# EAGLE design RCM-CamLight_v1 (EAGLE 9.3.1)
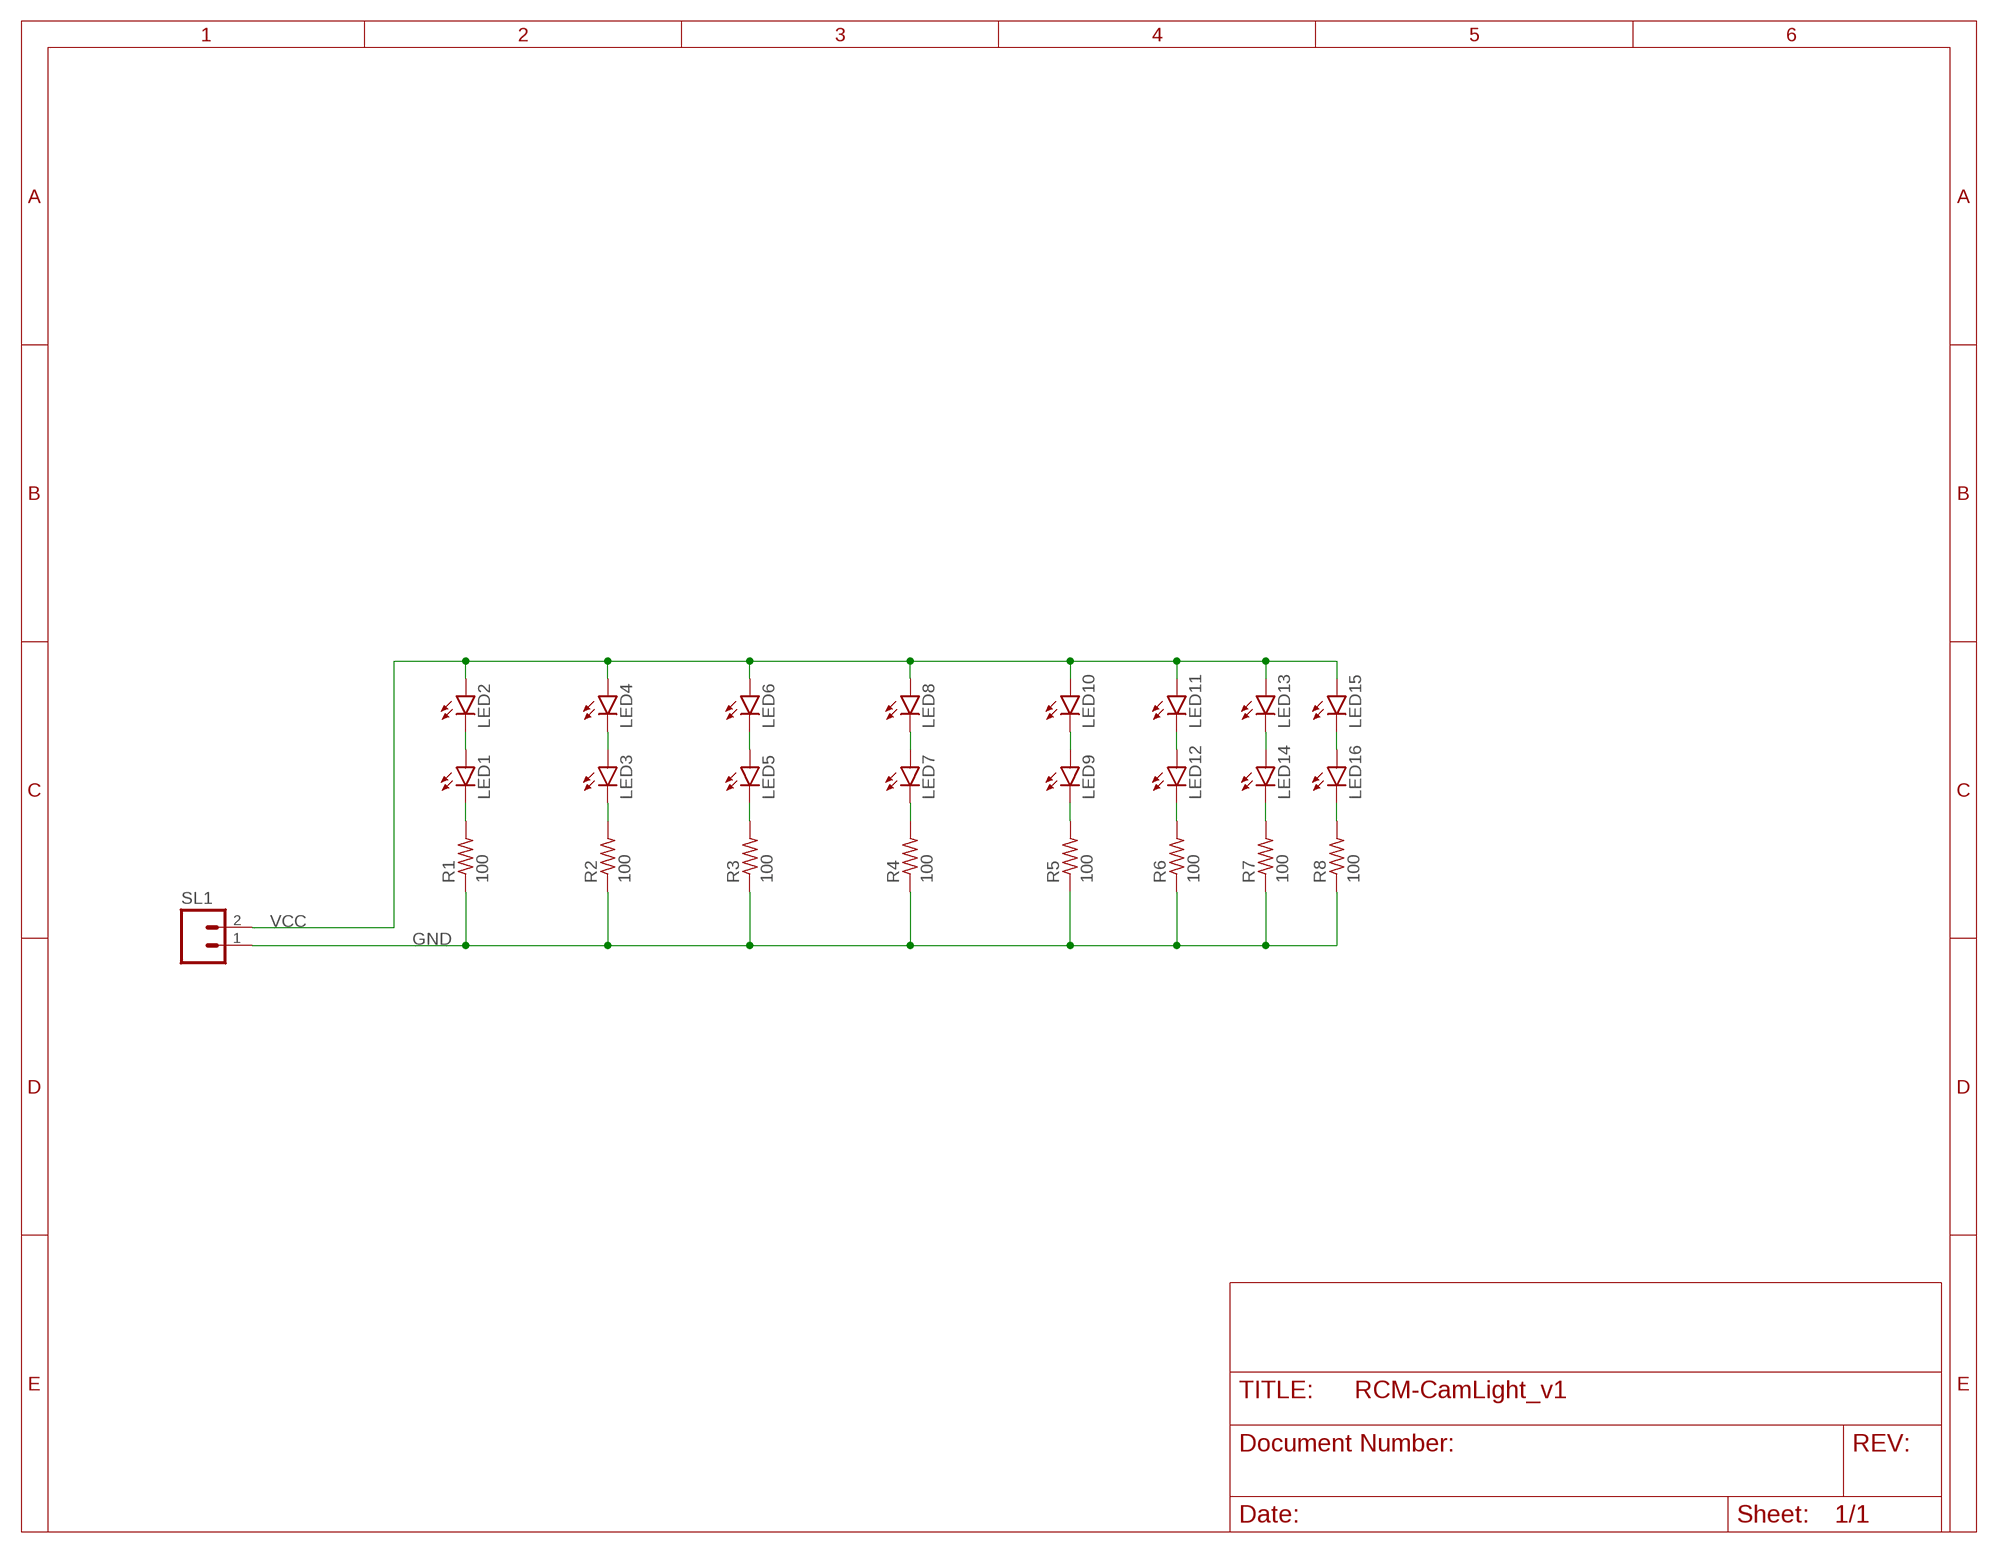
[diagram p0: schematic, sheet 1]

## Parts
LED1  LED3MM  [LED3MM]
LED2  LED3MM  [LED3MM]
LED3  LED3MM  [LED3MM]
LED4  LED3MM  [LED3MM]
LED5  LED3MM  [LED3MM]
LED6  LED3MM  [LED3MM]
LED7  LED3MM  [LED3MM]
LED8  LED3MM  [LED3MM]
LED9  LED3MM  [LED3MM]
LED10  LED3MM  [LED3MM]
LED11  LED3MM  [LED3MM]
LED12  LED3MM  [LED3MM]
LED13  LED3MM  [LED3MM]
LED14  LED3MM  [LED3MM]
LED15  LED3MM  [LED3MM]
LED16  LED3MM  [LED3MM]
R1  100  R-US_0204/7  [0204/7]
R2  100  R-US_0204/7  [0204/7]
R3  100  R-US_0204/7  [0204/7]
R4  100  R-US_0204/7  [0204/7]
R5  100  R-US_0204/7  [0204/7]
R6  100  R-US_0204/7  [0204/7]
R7  100  R-US_0204/7  [0204/7]
R8  100  R-US_0204/7  [0204/7]
SL1  M02  [02P]

## Nets
GND: R1.1 R2.1 R3.1 R4.1 R5.1 R6.1 R7.1 R8.1 SL1.1
N$1: LED9.A LED10.K(C)
N$3: LED12.K(C) R6.2
N$4: LED1.K(C) R1.2
N$5: LED1.A LED2.K(C)
N$6: LED3.A LED4.K(C)
N$7: LED3.K(C) R2.2
N$8: LED5.K(C) R3.2
N$9: LED5.A LED6.K(C)
N$10: LED7.A LED8.K(C)
N$11: LED7.K(C) R4.2
N$12: LED9.K(C) R5.2
N$14: LED14.K(C) R7.2
N$15: LED11.K(C) LED12.A
N$18: LED16.K(C) R8.2
N$19: LED15.K(C) LED16.A
N$20: LED13.K(C) LED14.A
VCC: LED2.A LED4.A LED6.A LED8.A LED10.A LED11.A LED13.A LED15.A SL1.2

## Library data of the parts
LED1-LED16 = led:LED: LED OSRAM: - CHIPLED LG R971, LG N971, LY N971, LG Q971, LY Q971, LO R971, LY R971 LH N974, LH R974 LS Q976, LO Q976, LY Q976 LO Q996 - Hyper CHIPLED LW Q18S LB Q993, LB Q99A, LB R99A - SideLED LS A670, LO A670, LY A670, LG A670, LP A670 LB A673, LV A673, LT A673, LW A673 LH A674 LY A675 LS A676, LA A676, LO A676, LY A676, LW A676 LS A679, LY A679, LG A679 - Hyper Micro SIDELED® LS Y876, LA Y876, LO Y876, LY Y876 LT Y87S - SmartLED LW L88C, LW L88S LB L89C, LB L89S, LG L890 LS L89K, LO L89K, LY L89K LS L896, LA L896, LO L896, LY L896 - TOPLED LS T670, LO T670, LY T670, LG T670, LP T670 LSG T670, LSP T670, LSY T670, LOP T670, LYG T670 LG T671, LOG T671, LSG T671 LB T673, LV T673, LT T673, LW T673 LH T674 LS T676, LA T676, LO T676, LY T676, LB T676, LH T676, LSB T676, LW T676 LB T67C, LV T67C, LT T67C, LS T67K, LO T67K, LY T67K, LW E67C LS E67B, LA E67B, LO E67B, LY E67B, LB E67C, LV E67C, LT E67C LW T67C LS T679, LY T679, LG T679 LS T770, LO T770, LY T770, LG T770, LP T770 LB T773, LV T773, LT T773, LW T773 LH T774 LS E675, LA E675, LY E675, LS T675 LS T776, LA T776, LO T776, LY T776, LB T776 LHGB T686 LT T68C, LB T68C - Hyper Mini TOPLED® LB M676 - Mini TOPLED Santana® LG M470 LS M47K, LO M47K, LY M47K Source: http://www.osram.convergy.de LUXEON: - LUMILED® LXK2-PW12-R00, LXK2-PW12-S00, LXK2-PW14-U00, LXK2-PW14-V00 LXK2-PM12-R00, LXK2-PM12-S00, LXK2-PM14-U00 LXK2-PE12-Q00, LXK2-PE12-R00, LXK2-PE12-S00, LXK2-PE14-T00, LXK2-PE14-U00 LXK2-PB12-K00, LXK2-PB12-L00, LXK2-PB12-M00, LXK2-PB14-N00, LXK2-PB14-P00, LXK2-PB14-Q00 LXK2-PR12-L00, LXK2-PR12-M00, LXK2-PR14-Q00, LXK2-PR14-R00 LXK2-PD12-Q00, LXK2-PD12-R00, LXK2-PD12-S00 LXK2-PH12-R00, LXK2-PH12-S00 LXK2-PL12-P00, LXK2-PL12-Q00, LXK2-PL12-R00 Source: www.luxeon.com KINGBRIGHT: KA-3528ASYC Source: www.kingbright.com
R1-R8 = rcl:R-US_: RESISTOR, American symbol; SPICEPREFIX: R
SL1 = con-amp-quick:M02: AMP QUICK CONNECTOR; OC_FARNELL: unknown; OC_NEWARK: unknown

## Board
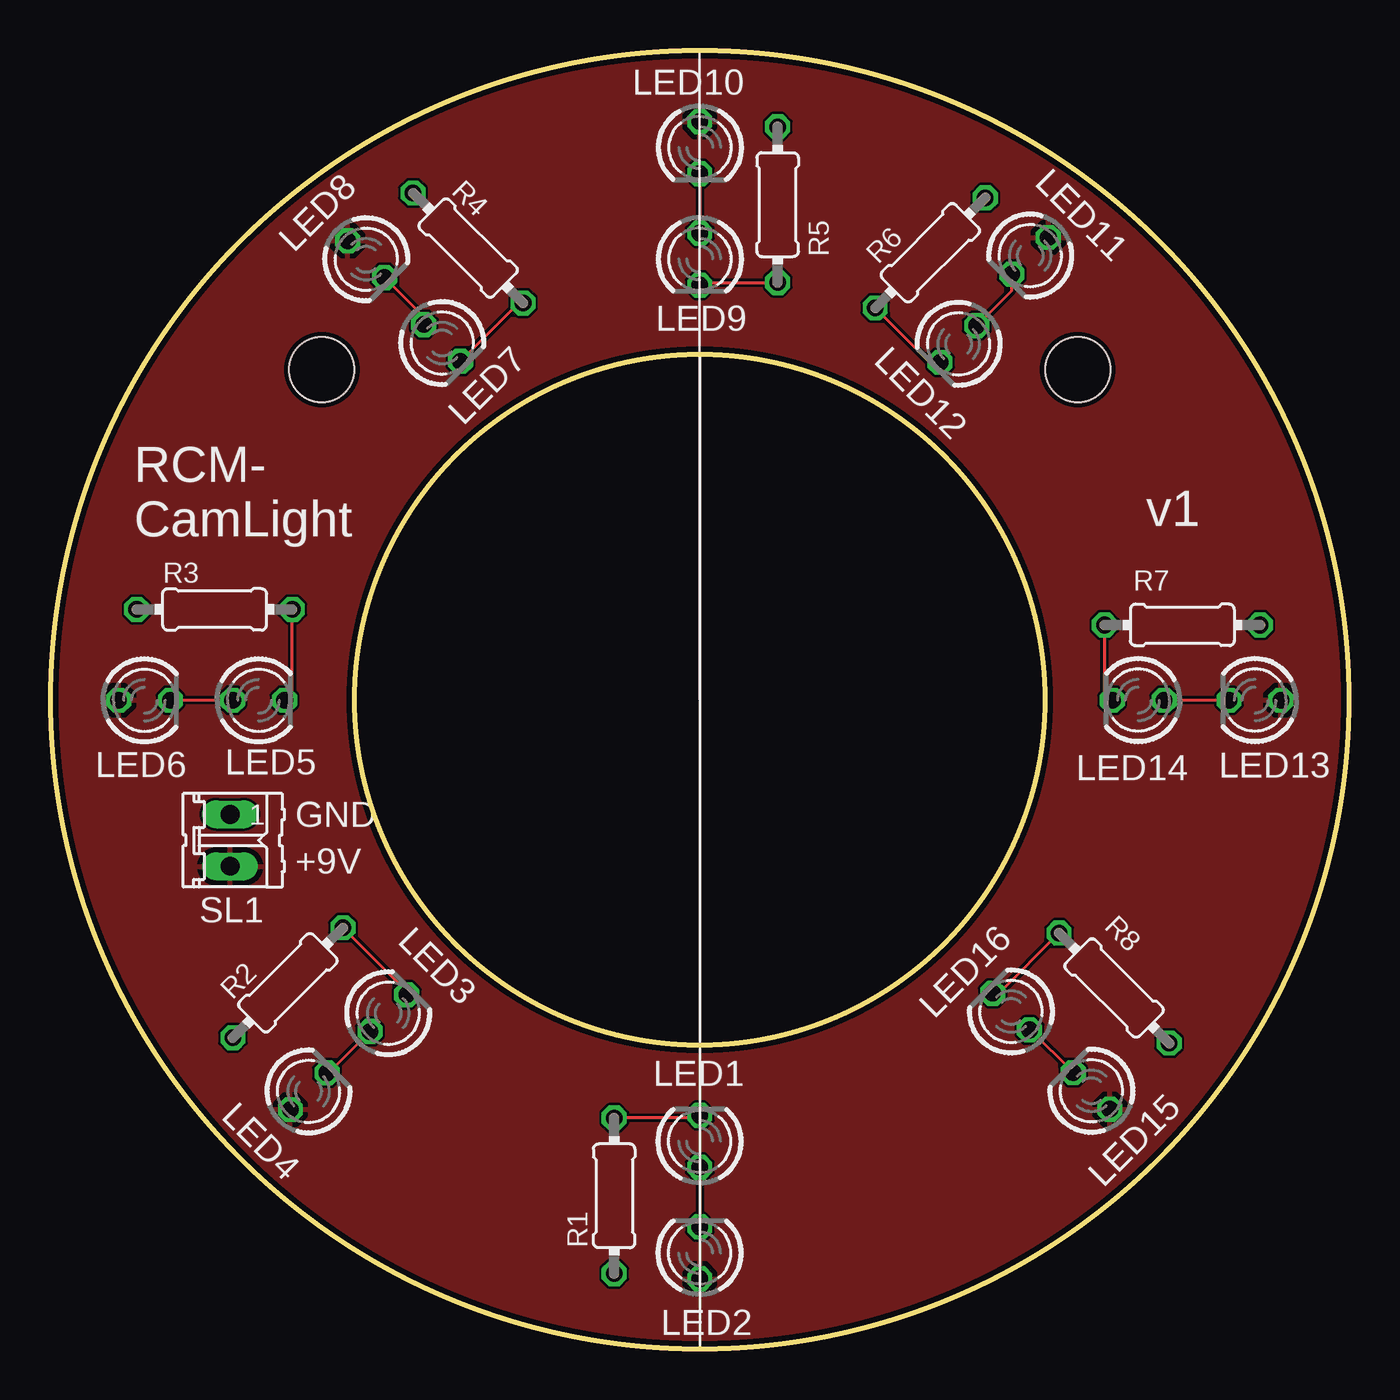
[diagram p1: board, top side]
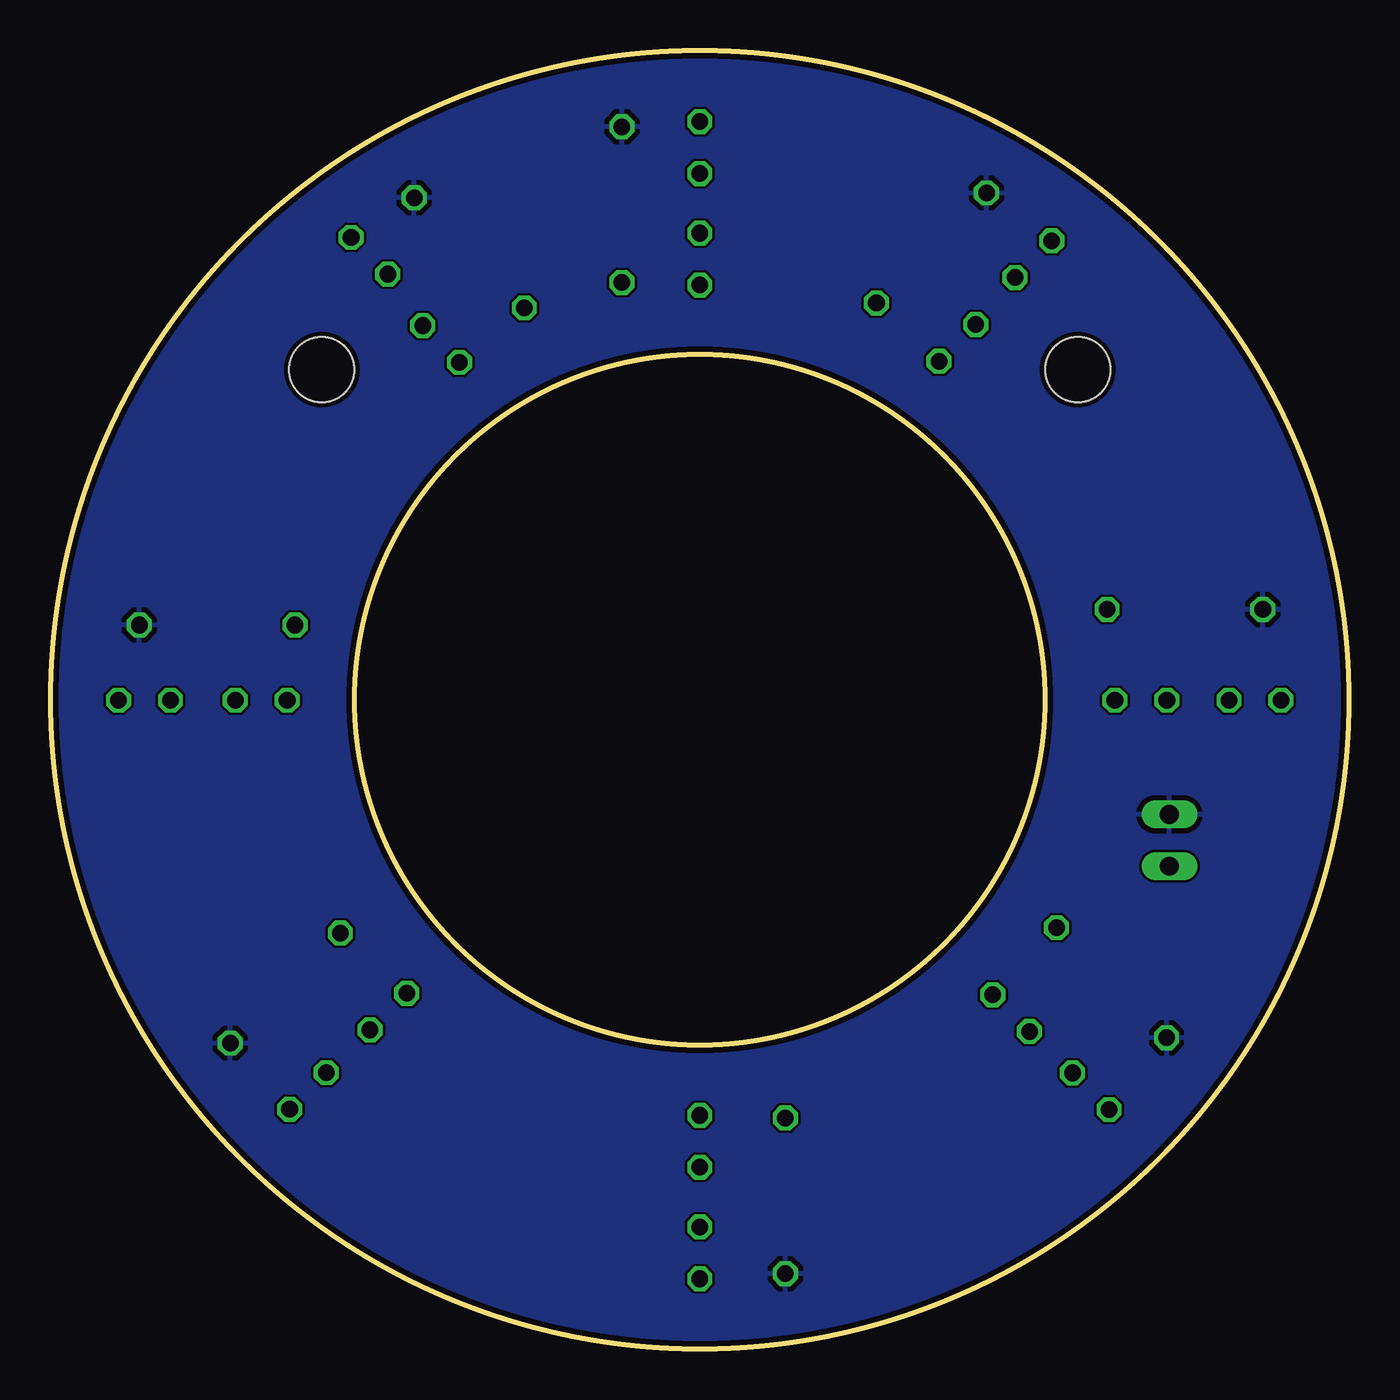
[diagram p2: board, bottom side, seen from below]

Size 63.5 x 63.5 mm. Coordinates in mm from the lower left corner, seen from the top.
Outline: circle at 31.75,31.75 radius 16.89
Outline: circle at 31.75,31.75 radius 31.75
Copper layers (1*16): Top 0.035mm / dielectric 0.2mm / Bottom 0.035mm
Design rules "JLCPCB_DRU_2layer *": minimum track width 5mil, minimum drill 0.3mm, track to track 5mil, track to pad 5mil, pad to pad 5mil, via to via 5mil, smd to smd 5mil, copper to edge 10mil, drill to drill 10mil, minimum pad ring 6mil, minimum via ring 6mil, stop-mask expansion 2mil, vias tented up to drill 25mil, thermal gap 10mil
Holes 3.17 mm at 13.25,47.9 50.25,47.9

### Footprints (pad centres in the part's own frame; a part is rotated, then mirrored left to right if it is on the bottom)
LED3MM = drill 0.813 octagon: A -1.27,0; K 1.27,0
0204/7 = drill 0.813 octagon: 1 -3.81,0; 2 3.81,0
02P = drill 0.914 long: 1 -1.27,0; 2 1.27,0

### Placement (x,y rotation side)
LED1  31.75,10.14 90 top
LED2  31.75,4.68 90 top
LED3  16.51,16.41 45 top
LED4  12.61,12.59 45 top
LED5  10.16,31.73 0 top
LED6  4.57,31.73 0 top
LED7  19.14,49.22 315 top
LED8  15.42,53.32 315 top
LED9  31.75,53.32 270 top
LED10  31.75,58.78 270 top
LED11  47.92,53.48 225 top
LED12  44.41,49.16 225 top
LED13  58.93,31.73 180 top
LED14  53.21,31.73 180 top
LED15  50.93,12.6 135 top
LED16  46.99,16.49 135 top
R1  27.56,7.47 90 top
R2  11.59,17.9 45 top
R3  8,36.17 0 top
R4  20.41,53.86 315 top
R5  35.56,55.98 270 top
R6  43.03,53.62 225 top
R7  55.37,35.41 180 top
R8  52.03,17.64 135 top
SL1  8.76,24.87 270 top

### Tracks (layer width: path | path; a pad name or v marks a point on that pad's centre or on a via)
GND
  pour Bottom: -3.81,66.14 67.31,66.14 67.31,-2.44 -3.81,-2.44
N$1
  Top 0.152: LED10.K LED9.A
N$3
  Top 0.152: R6.2 43,48.27 LED12.K
N$4
  Top 0.152: LED1.K 31.62,11.28 R1.2
N$5
  Top 0.152: LED1.A LED2.K
N$6
  Top 0.152: LED3.A 13.58,13.49 LED4.K
N$7
  Top 0.152: R2.2 17.41,17.47 LED3.K
N$8
  Top 0.152: LED5.K 11.81,32.11 R3.2
N$9
  Top 0.152: LED6.K LED5.A
N$10
  Top 0.152: LED8.K 18.24,50.5 LED7.A
N$11
  Top 0.152: LED7.K 22.89,51.17 R4.2
N$12
  Top 0.152: LED9.K 31.88,52.17 R5.2
N$14
  Top 0.152: R7.2 51.56,32.11 LED14.K
N$15
  Top 0.152: LED12.A 47.02,51.77 LED11.K
N$18
  Top 0.152: R8.2 46.39,17.39 LED16.K
N$19
  Top 0.152: LED15.K 47.94,15.59 LED16.A
N$20
  Top 0.152: LED14.A LED13.K
VCC
  pour Top: -3.81,66.14 67.31,66.14 67.31,-2.44 -3.81,-2.44

### Text on the board
tPlace: RCM- / CamLight | v1 | GND | +9V